# Altium schematic sheet A02_DRV8316.SchDoc: A02_DRV8316
size 420 x 296 mm; Revision: A-SCH-AD-R2-NO-TP; SheetNumber: 2; SheetTotal: 7
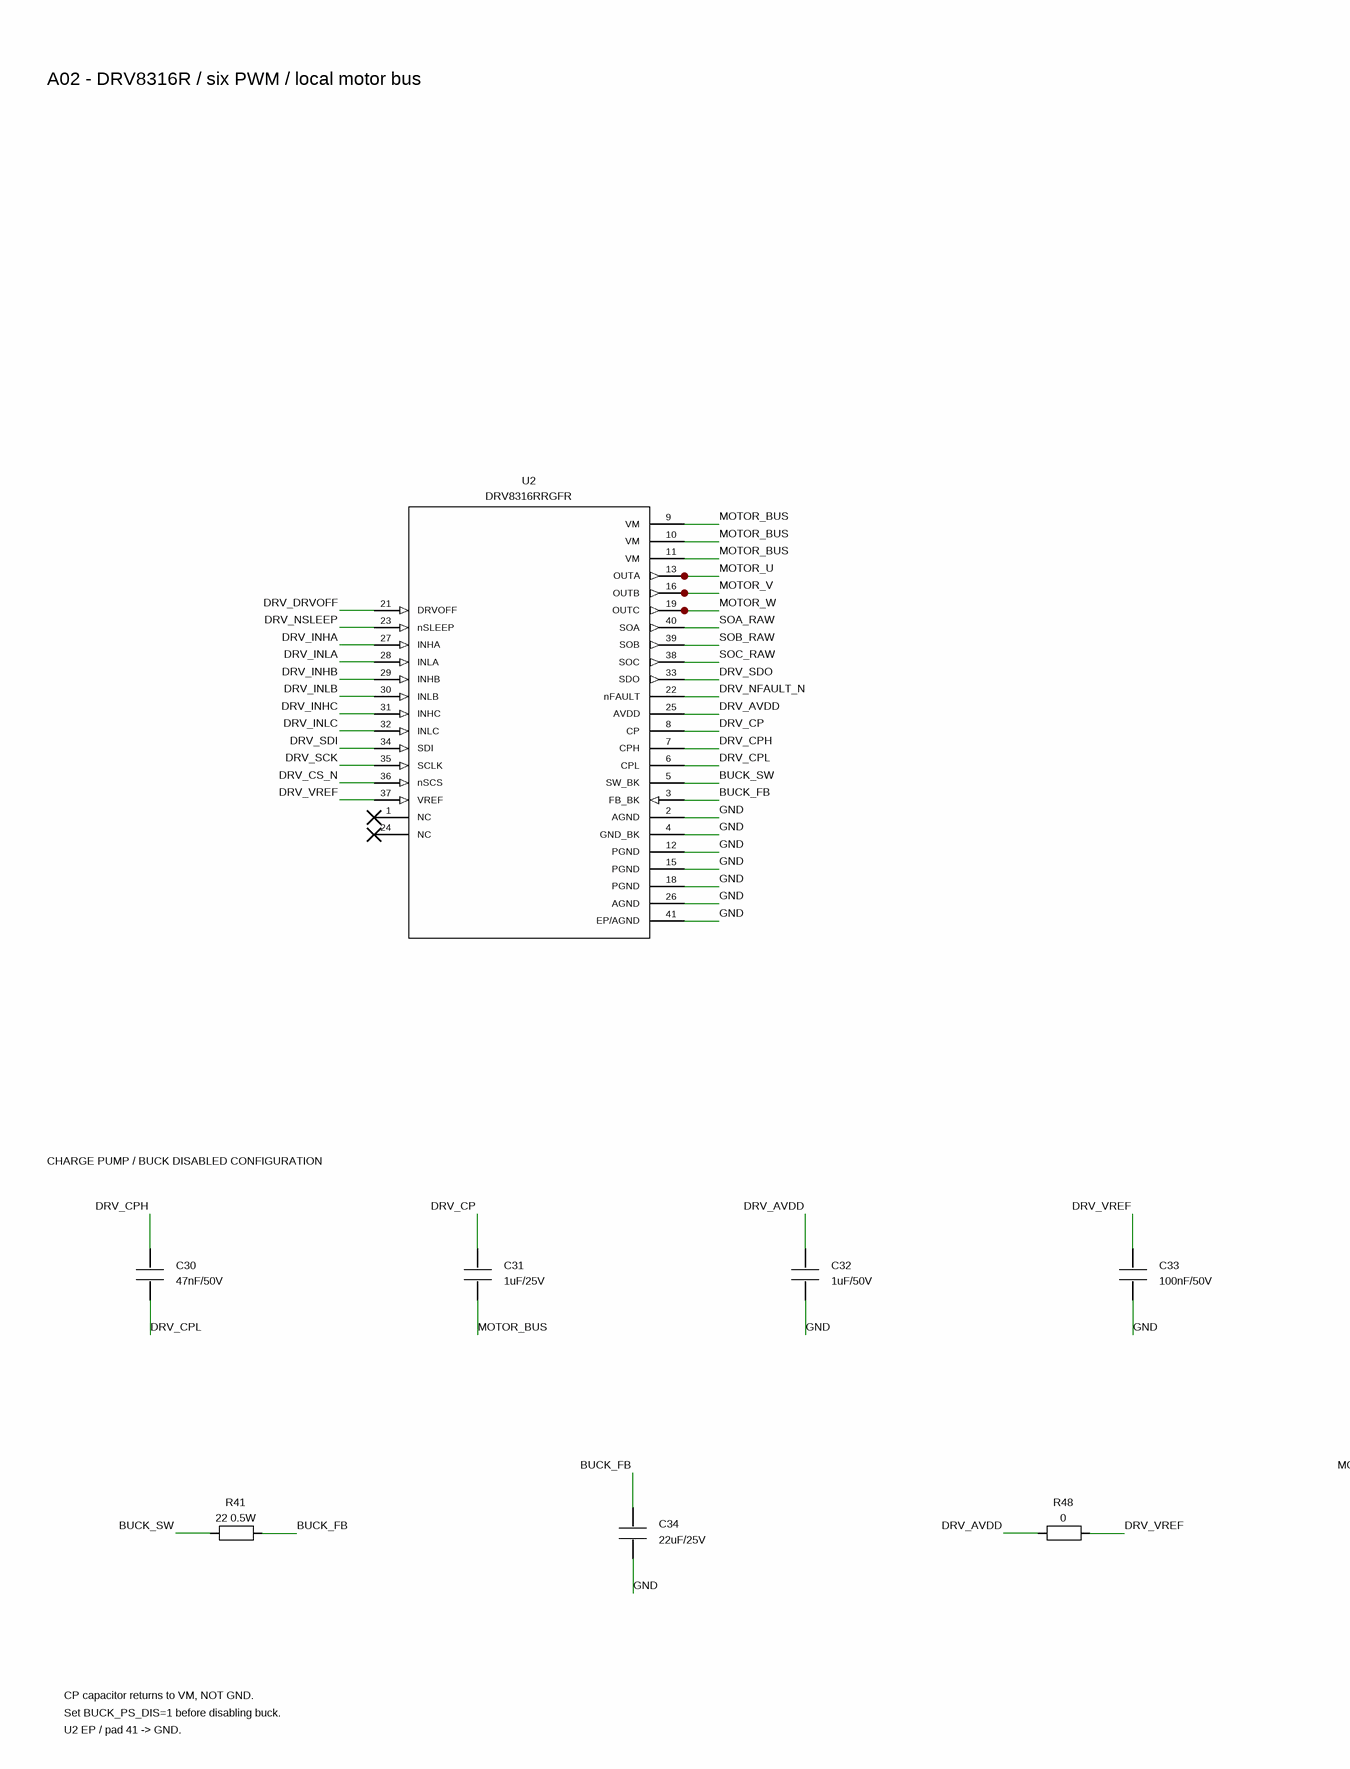
[diagram p0: A02_DRV8316.SchDoc, left]
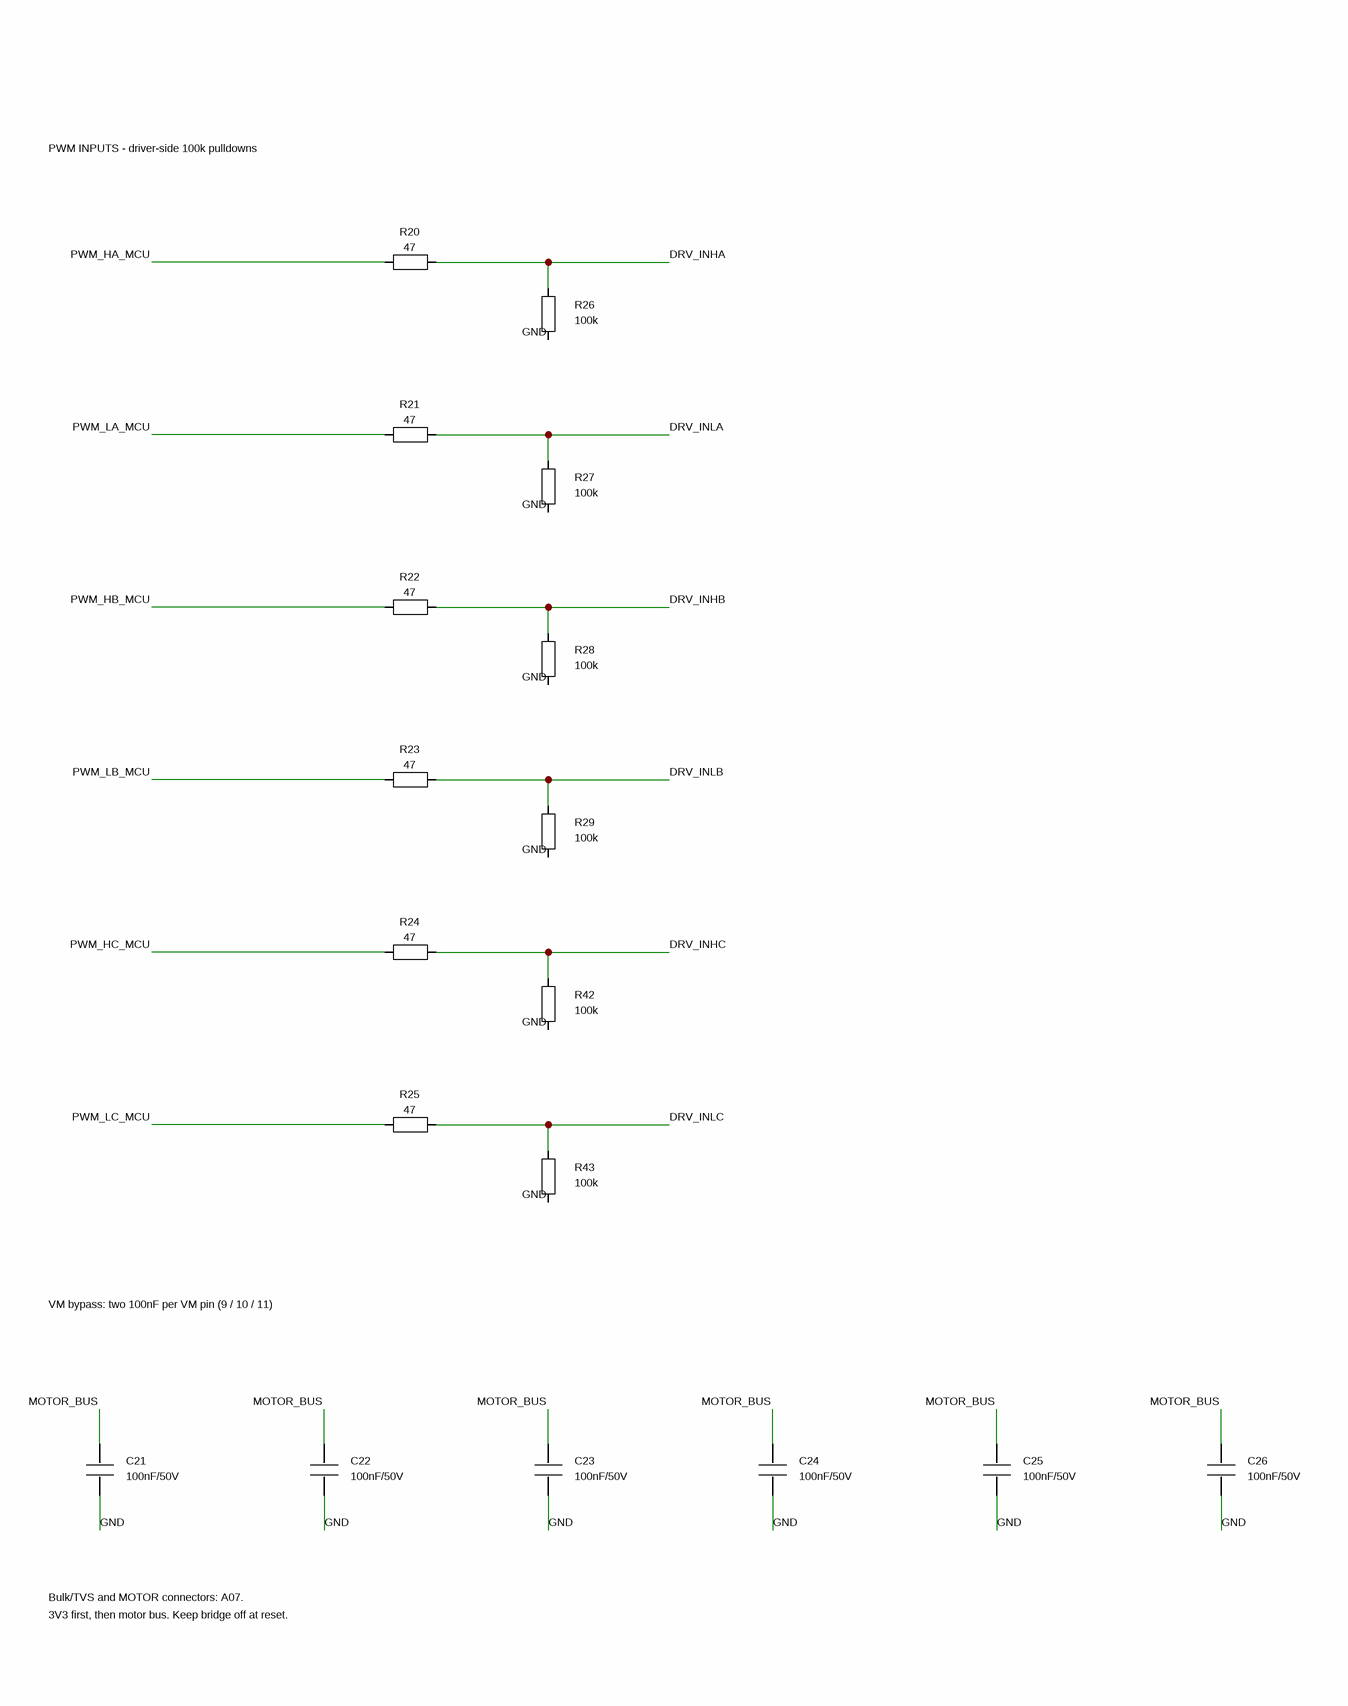
[diagram p1: A02_DRV8316.SchDoc, right]

## Parts
C21  100nF/50V  [C0603_M]
C22  100nF/50V  [C0603_M]
C23  100nF/50V  [C0603_M]
C24  100nF/50V  [C0603_M]
C25  100nF/50V  [C0603_M]
C26  100nF/50V  [C0603_M]
C30  47nF/50V  [C0603_M]
C31  1uF/25V  [C0603_M]
C32  1uF/50V  [C0805_M]
C33  100nF/50V  [C0603_M]
C34  22uF/25V  [C0805_M]
R20  47  [R0603_M]
R21  47  [R0603_M]
R22  47  [R0603_M]
R23  47  [R0603_M]
R24  47  [R0603_M]
R25  47  [R0603_M]
R26  100k  [R0603_M]
R27  100k  [R0603_M]
R28  100k  [R0603_M]
R29  100k  [R0603_M]
R41  22 0.5W  [RESC3116X65N]
R42  100k  [R0603_M]
R43  100k  [R0603_M]
R48  0  [R0603_M]
U2  DRV8316RRGFR  [C5218861_VQFN-40_5x7]

## Nets
BUCK_FB: C34.1 R41.2 U2.3(FB_BK)
BUCK_SW: R41.1 U2.5(SW_BK)
DRV_AVDD: C32.1 R48.1 U2.25(AVDD)
DRV_CP: C31.1 U2.8(CP)
DRV_CPH: C30.1 U2.7(CPH)
DRV_CPL: C30.2 U2.6(CPL)
DRV_CS_N: U2.36(nSCS)
DRV_DRVOFF: U2.21(DRVOFF)
DRV_INHA: R20.2 R26.1 U2.27(INHA)
DRV_INHB: R22.2 R28.1 U2.29(INHB)
DRV_INHC: R24.2 R42.1 U2.31(INHC)
DRV_INLA: R21.2 R27.1 U2.28(INLA)
DRV_INLB: R23.2 R29.1 U2.30(INLB)
DRV_INLC: R25.2 R43.1 U2.32(INLC)
DRV_NFAULT_N: U2.22(nFAULT)
DRV_NSLEEP: U2.23(nSLEEP)
DRV_SCK: U2.35(SCLK)
DRV_SDI: U2.34(SDI)
DRV_SDO: U2.33(SDO)
DRV_VREF: C33.1 R48.2 U2.37(VREF)
GND: C21.2 C22.2 C23.2 C24.2 C25.2 C26.2 C32.2 C33.2 C34.2 R26.2 R27.2 R28.2 R29.2 R42.2 R43.2 U2.2(AGND) U2.4(GND_BK) U2.12(PGND) U2.15(PGND) U2.18(PGND) U2.26(AGND) U2.41(EP/AGND)
MOTOR_BUS: C21.1 C22.1 C23.1 C24.1 C25.1 C26.1 C31.2 U2.9(VM) U2.10(VM) U2.11(VM)
MOTOR_U: U2.13(OUTA) U2.14(OUTA)
MOTOR_V: U2.16(OUTB) U2.17(OUTB)
MOTOR_W: U2.19(OUTC) U2.20(OUTC)
PWM_HA_MCU: R20.1
PWM_HB_MCU: R22.1
PWM_HC_MCU: R24.1
PWM_LA_MCU: R21.1
PWM_LB_MCU: R23.1
PWM_LC_MCU: R25.1
SOA_RAW: U2.40(SOA)
SOB_RAW: U2.39(SOB)
SOC_RAW: U2.38(SOC)

Not connected (* = marked no-connect by the designer): U2 1(NC)* 24(NC)*

## Notes on the sheet
- A02 - DRV8316R / six PWM / local motor bus
- PWM INPUTS - driver-side 100k pulldowns
- CHARGE PUMP / BUCK DISABLED CONFIGURATION
- VM bypass: two 100nF per VM pin (9 / 10 / 11)
- CP capacitor returns to VM, NOT GND.
- Bulk/TVS and MOTOR connectors: A07.
- 3V3 first, then motor bus. Keep bridge off at reset.
- Set BUCK_PS_DIS=1 before disabling buck.
- U2 EP / pad 41 -> GND.

## Library data of the parts
C21 = C: 电容; MPN: CL10B104KB8NNNC; Source_KiCad_Footprint: GL30:C_0603_1608Metric; Specification: 100 nF / 50 V X7R; Design_note: VM脚9的第1颗，就近; Assembly: FITTED; PCB_Model_Status: USER_LIBRARY_LINKED_PIN_NUMBERS_CHECKED; Package: 0603; Footprint_status: LIBRARY_SELECTED_PENDING_LAYOUT_REVIEW; Value: 100nF/50V
C22 = C: 电容; MPN: CL10B104KB8NNNC; Source_KiCad_Footprint: GL30:C_0603_1608Metric; Specification: 100 nF / 50 V X7R; Design_note: VM脚9的第2颗，就近; Assembly: FITTED; PCB_Model_Status: USER_LIBRARY_LINKED_PIN_NUMBERS_CHECKED; Package: 0603; Footprint_status: LIBRARY_SELECTED_PENDING_LAYOUT_REVIEW; Value: 100nF/50V
C23 = C: 电容; MPN: CL10B104KB8NNNC; Source_KiCad_Footprint: GL30:C_0603_1608Metric; Specification: 100 nF / 50 V X7R; Design_note: VM脚10的第1颗，就近; Assembly: FITTED; PCB_Model_Status: USER_LIBRARY_LINKED_PIN_NUMBERS_CHECKED; Package: 0603; Footprint_status: LIBRARY_SELECTED_PENDING_LAYOUT_REVIEW; Value: 100nF/50V
C24 = C: 电容; MPN: CL10B104KB8NNNC; Source_KiCad_Footprint: GL30:C_0603_1608Metric; Specification: 100 nF / 50 V X7R; Design_note: VM脚10的第2颗，就近; Assembly: FITTED; PCB_Model_Status: USER_LIBRARY_LINKED_PIN_NUMBERS_CHECKED; Package: 0603; Footprint_status: LIBRARY_SELECTED_PENDING_LAYOUT_REVIEW; Value: 100nF/50V
C25 = C: 电容; MPN: CL10B104KB8NNNC; Source_KiCad_Footprint: GL30:C_0603_1608Metric; Specification: 100 nF / 50 V X7R; Design_note: VM脚11的第1颗，就近; Assembly: FITTED; PCB_Model_Status: USER_LIBRARY_LINKED_PIN_NUMBERS_CHECKED; Package: 0603; Footprint_status: LIBRARY_SELECTED_PENDING_LAYOUT_REVIEW; Value: 100nF/50V
C26 = C: 电容; MPN: CL10B104KB8NNNC; Source_KiCad_Footprint: GL30:C_0603_1608Metric; Specification: 100 nF / 50 V X7R; Design_note: VM脚11的第2颗，就近; Assembly: FITTED; PCB_Model_Status: USER_LIBRARY_LINKED_PIN_NUMBERS_CHECKED; Package: 0603; Footprint_status: LIBRARY_SELECTED_PENDING_LAYOUT_REVIEW; Value: 100nF/50V
C30 = C: 电容; MPN: CL10B473KB8NNNC; Source_KiCad_Footprint: GL30:C_0603_1608Metric; Specification: 47 nF / 50 V X7R; Design_note: 飞跨电容；不是接地; Assembly: FITTED; PCB_Model_Status: USER_LIBRARY_LINKED_PIN_NUMBERS_CHECKED; Package: 0603; Footprint_status: LIBRARY_SELECTED_PENDING_LAYOUT_REVIEW; Value: 47nF/50V
C31 = C: 电容; MPN: CL10A105KA8NNNC; Source_KiCad_Footprint: GL30:C_0603_1608Metric; Specification: 1 µF / 25 V X5R; Design_note: 充电泵电容；不是CP接地; Assembly: FITTED; PCB_Model_Status: USER_LIBRARY_LINKED_PIN_NUMBERS_CHECKED; Package: 0603; Footprint_status: LIBRARY_SELECTED_PENDING_LAYOUT_REVIEW; Value: 1uF/25V
C32 = C: 电容; MPN: CL21B105KBFNNNE; Source_KiCad_Footprint: GL30:C_0805_2012Metric; Specification: 1 µF / 50 V X7R; Design_note: 需在3.3V/全温下有效0.7–1.3µF；按实购曲线复核; Assembly: FITTED; PCB_Model_Status: USER_LIBRARY_LINKED_PIN_NUMBERS_CHECKED; Package: 0805; Footprint_status: LIBRARY_SELECTED_PENDING_LAYOUT_REVIEW; Value: 1uF/50V
C33 = C: 电容; MPN: CL10B104KB8NNNC; Source_KiCad_Footprint: GL30:C_0603_1608Metric; Specification: 100 nF / 50 V X7R; Assembly: FITTED; PCB_Model_Status: USER_LIBRARY_LINKED_PIN_NUMBERS_CHECKED; Package: 0603; Footprint_status: LIBRARY_SELECTED_PENDING_LAYOUT_REVIEW; Value: 100nF/50V
C34 = C: 电容; MPN: CL21A226MAQNNNE; Source_KiCad_Footprint: GL30:C_0805_2012Metric; Specification: 22 µF / 25 V X5R; Design_note: 内部Buck未使用仍装；5V_LOGIC不能接这里; Assembly: FITTED; PCB_Model_Status: USER_LIBRARY_LINKED_PIN_NUMBERS_CHECKED; Package: 0805; Footprint_status: LIBRARY_SELECTED_PENDING_LAYOUT_REVIEW; Value: 22uF/25V
R20-R25 = R: 电阻; MPN: 通用厚膜 47 1% 0.1 W; Source_KiCad_Footprint: GL30:R_0603_1608Metric; Specification: 47 Ω；1%；0.1 W; Assembly: FITTED; PCB_Model_Status: USER_LIBRARY_LINKED_PIN_NUMBERS_CHECKED; Package: 0603; Footprint_status: LIBRARY_SELECTED_PENDING_LAYOUT_REVIEW; Value: 47
R26-R29 R42 R43 = R: 电阻; MPN: 通用厚膜 100k 1% 0.1 W; Source_KiCad_Footprint: GL30:R_0603_1608Metric; Specification: 100k Ω；1%；0.1 W; Design_note: 放驱动器侧; Assembly: FITTED; PCB_Model_Status: USER_LIBRARY_LINKED_PIN_NUMBERS_CHECKED; Package: 0603; Footprint_status: LIBRARY_SELECTED_PENDING_LAYOUT_REVIEW; Value: 100k
R41 = R: 电阻; MPN: 通用厚膜 22 1% 0.5 W; Source_KiCad_Footprint: GL30:R_1206_3216Metric; Specification: 22 Ω；1%；0.5 W; Design_note: 内部Buck不用也保留；脉冲型≥0.5W，不能替成0603; Assembly: FITTED; PCB_Model_Status: USER_LIBRARY_LINKED_PIN_NUMBERS_CHECKED; Package: 1206; Footprint_status: LIBRARY_SELECTED_PENDING_LAYOUT_REVIEW; Value: 22 0.5W
R48 = R: 电阻; MPN: 通用0Ω跳线 0.1 W; Source_KiCad_Footprint: GL30:R_0603_1608Metric; Specification: 0 Ω跳线；0.1 W; Assembly: FITTED; PCB_Model_Status: USER_LIBRARY_LINKED_PIN_NUMBERS_CHECKED; Package: 0603; Footprint_status: LIBRARY_SELECTED_PENDING_LAYOUT_REVIEW; Value: 0
U2 = DRV8316RRGFR: 三相集成驱动; Design_note: R版SPI；每个VM脚配2颗100n；裸露焊盘必须接地; Assembly: FITTED; PCB_Model_Status: USER_LIBRARY_LINKED_PIN_NUMBERS_CHECKED; Datasheet: https://www.ti.com/lit/ds/symlink/drv8316.pdf; MPN: DRV8316RRGFR; Package: RGF VQFN40 7×5 mm + EP; Specification: DRV8316RRGFR; Footprint_status: PENDING_PHYSICAL_FOOTPRINT_REVIEW; Value: DRV8316RRGFR